# Altium schematic sheet mcu_stm32.SchDoc
size 297 x 209 mm
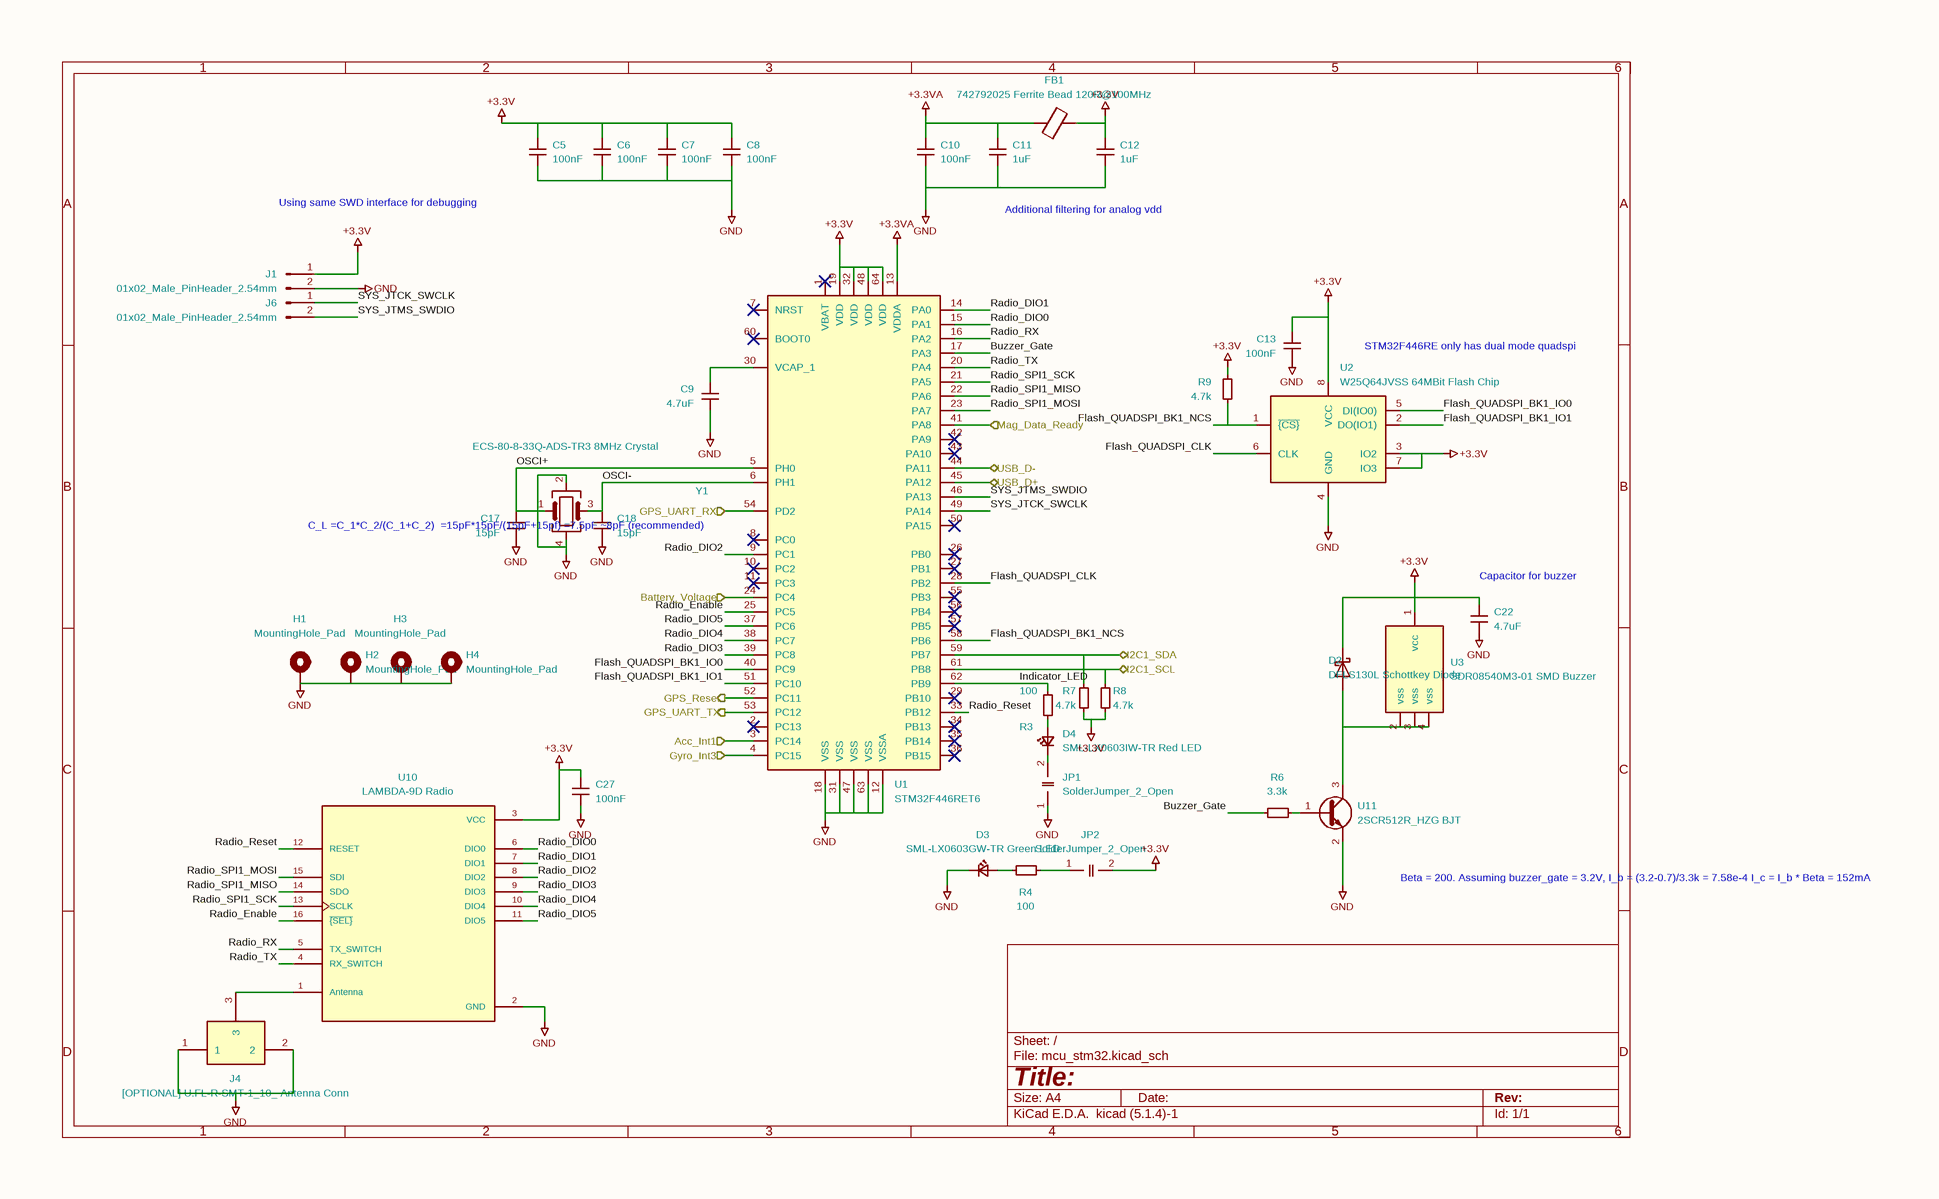
[diagram p0: mcu_stm32.SchDoc]

## Parts
C5  100nF  [C_0603_1608Metric]
C6  100nF  [C_0603_1608Metric]
C7  100nF  [C_0603_1608Metric]
C8  100nF  [C_0603_1608Metric]
C9  4.7uF  [C_0603_1608Metric]
C10  100nF  [C_0603_1608Metric]
C11  1uF  [C_0603_1608Metric]
C12  1uF  [C_0603_1608Metric]
C13  100nF  [C_0603_1608Metric]
C17  15pF  [C_0603_1608Metric]
C18  15pF  [C_0603_1608Metric]
C22  4.7uF  [C_0603_1608Metric]
C27  100nF  [C_0603_1608Metric_Pad1.08x0.95mm_HandSolder]
D2  DFLS130L Schottkey Diode  [PowerDI123]
D3  SML-LX0603GW-TR Green LED  [C_0603_1608Metric]
D4  SML-LX0603IW-TR Red LED  [C_0603_1608Metric]
FB1  742792025 Ferrite Bead 120R@100MHz  [R_0805_2012Metric_Pad1.20x1.40mm_HandSolder]
H1  MountingHole_Pad  [MountingHole_3.2mm_M3_ISO7380_Pad_TopBottom]
H2  MountingHole_Pad  [MountingHole_3.2mm_M3_ISO7380_Pad_TopBottom]
H3  MountingHole_Pad  [MountingHole_3.2mm_M3_ISO7380_Pad_TopBottom]
H4  MountingHole_Pad  [MountingHole_3.2mm_M3_ISO7380_Pad_TopBottom]
J1  01x02_Male_PinHeader_2.54mm  [PinHeader_1x02_P2.54mm_Vertical]
J4  [OPTIONAL] U.FL-R-SMT-1_10_ Antenna Conn  [U.FL-R-SMT-1_10_]
J6  01x02_Male_PinHeader_2.54mm  [PinHeader_1x02_P2.54mm_Vertical]
JP1  SolderJumper_2_Open  [SolderJumper-2_P1.3mm_Open_TrianglePad1.0x1.5mm]
JP2  SolderJumper_2_Open  [SolderJumper-2_P1.3mm_Open_TrianglePad1.0x1.5mm]
R3  100  [R_0603_1608Metric]
R4  100  [R_0603_1608Metric]
R6  3.3k  [R_0603_1608Metric]
R7  4.7k  [R_0603_1608Metric]
R8  4.7k  [R_0603_1608Metric]
R9  4.7k  [R_0603_1608Metric]
U1  STM32F446RET6  [LQFP-64_10x10mm_P0.5mm]
U2  W25Q64JVSS 64MBit Flash Chip  [W25Q64JVSSIQ]
U3  SDR08540M3-01 SMD Buzzer  [SDR08540M3-01 Buzzer]
U10  LAMBDA-9D Radio  [XCVR_LAMBDA-9D]
U11  2SCR512R_HZG BJT  [2SCR512RHZG]
Y1  ECS-80-8-33Q-ADS-TR3 8MHz Crystal  [ECS-80-8-33Q-ADS-TR3 Crystal]

## Ports
Acc_Int1 (in), Battery_Voltage (in), GPS_Reset (out), GPS_UART_RX (in), GPS_UART_TX (out), Gyro_Int3 (in), I2C1_SCL (bidir), I2C1_SDA (bidir), Mag_Data_Ready (in), USB_D+ (bidir), USB_D- (bidir)

## Nets
+3.3V: C5.1 C6.1 C7.1 C8.1 C12.1 C13.1 C22.1 C27.1 D2.1(K) FB1.2 J1.1(Pin_1) JP2.2(B) R7.2 R8.2 R9.1 U1.19(VDD) U1.32(VDD) U1.48(VDD) U1.64(VDD) U2.3(IO2) U2.7(IO3) U2.8(VCC) U3.1(vcc) U10.3(VCC)
+3.3VA: C10.1 C11.1 FB1.1 U1.13(VDDA)
GND: C5.2 C6.2 C7.2 C8.2 C9.2 C10.2 C11.2 C12.2 C13.2 C17.2 C18.2 C22.2 C27.2 D3.1(K) H1.1 H2.1 H3.1 H4.1 J1.2(Pin_2) J4.1 J4.2 JP1.1(A) U1.12(VSSA) U1.18(VSS) U1.31(VSS) U1.47(VSS) U1.63(VSS) U2.4(GND) U10.2(GND) U11.2(E) Y1.2 Y1.4
Acc_Int1: U1.3(PC14) ; port Acc_Int1
Battery_Voltage: U1.24(PC4) ; port Battery_Voltage
Buzzer_Gate: R6.1 U1.17(PA3)
Flash_QUADSPI_BK1_IO0: U1.40(PC9) U2.5(DI(IO0))
Flash_QUADSPI_BK1_IO1: U1.51(PC10) U2.2(DO(IO1))
Flash_QUADSPI_BK1_NCS: R9.2 U1.58(PB6) U2.1(~{{CS}})
Flash_QUADSPI_CLK: U1.28(PB2) U2.6(CLK)
GPS_Reset: U1.52(PC11) ; port GPS_Reset
GPS_UART_RX: U1.54(PD2) ; port GPS_UART_RX
GPS_UART_TX: U1.53(PC12) ; port GPS_UART_TX
Gyro_Int3: U1.4(PC15) ; port Gyro_Int3
I2C1_SCL: R8.1 U1.61(PB8) ; port I2C1_SCL
I2C1_SDA: R7.1 U1.59(PB7) ; port I2C1_SDA
Indicator_LED: R3.1 U1.62(PB9)
Mag_Data_Ready: U1.41(PA8) ; port Mag_Data_Ready
OSCI+: C17.1 U1.5(PH0) Y1.1
OSCI-: C18.1 U1.6(PH1) Y1.3
Radio_DIO0: U1.15(PA1) U10.6(DIO0)
Radio_DIO1: U1.14(PA0) U10.7(DIO1)
Radio_DIO2: U1.9(PC1) U10.8(DIO2)
Radio_DIO3: U1.39(PC8) U10.9(DIO3)
Radio_DIO4: U1.38(PC7) U10.10(DIO4)
Radio_DIO5: U1.37(PC6) U10.11(DIO5)
Radio_Enable: U1.25(PC5) U10.16(~{{SEL}})
Radio_Reset: U1.33(PB12) U10.12(RESET)
Radio_RX: U1.16(PA2) U10.5(TX_SWITCH)
Radio_SPI1_MISO: U1.22(PA6) U10.14(SDO)
Radio_SPI1_MOSI: U1.23(PA7) U10.15(SDI)
Radio_SPI1_SCK: U1.21(PA5) U10.13(SCLK)
Radio_TX: U1.20(PA4) U10.4(RX_SWITCH)
SYS_JTCK_SWCLK: J6.1(Pin_1) U1.49(PA14)
SYS_JTMS_SWDIO: J6.2(Pin_2) U1.46(PA13)
USB_D+: U1.45(PA12) ; port USB_D+
USB_D-: U1.44(PA11) ; port USB_D-
NetC9_1: C9.1 U1.30(VCAP_1)
NetD2_2: D2.2(A) U3.2(vss) U3.3(vss) U3.4(vss) U11.3(C)
NetD3_2: D3.2(A) R4.1
NetD4_1: D4.1(K) JP1.2(B)
NetD4_2: D4.2(A) R3.2
NetJ4_3: J4.3 U10.1(Antenna)
NetJP2_1: JP2.1(A) R4.2
NetR6_2: R6.2 U11.1(B)

Not connected (* = marked no-connect by the designer): U1 1(VBAT)* 2(PC13)* 7(NRST)* 8(PC0)* 10(PC2)* 11(PC3)* 26(PB0)* 27(PB1)* 29(PB10)* 34(PB13)* 35(PB14)* 36(PB15)* 42(PA9)* 43(PA10)* 50(PA15)* 55(PB3)* 56(PB4)* 57(PB5)* 60(BOOT0)*

## Notes on the sheet
- Using same SWD interface for debugging
- Additional filtering for analog vdd
- (near U2) STM32F446RE only has dual mode quadspi
- C_L
  =C_1*C_2/(C_1+C_2)
  =15pF*15pF/(15pF+15pf)
  =7.5pF ~8pF (recommended)
- (near C22) Capacitor for buzzer
- Beta = 200.
  Assuming buzzer_gate = 3.2V,
  I_b = (3.2-0.7)/3.3k = 7.58e-4
  I_c = I_b * Beta = 152mA
- 1
- 2
- 3
- 4
- 5
- 6
- A
- B
- C
- D
- Title:
- File: mcu_stm32.kicad_sch
- Sheet: /
- KiCad E.D.A.  kicad (5.1.4)-1
- Size: A4
- Date:
- Rev:
- Id: 1/1

## Library data of the parts
C5-C13 C17 C18 C22 = C_0603: Footprint: Components:C_0603_1608Metric
  C5-C8 C10 C13: Value: 100nF
  C9 C22: Value: 4.7uF
  C11 C12: Value: 1uF
  C17 C18: Value: 15pF
C27 = C_Small: Value: 100nF; Footprint: Capacitor_SMD:C_0603_1608Metric_Pad1.08x0.95mm_HandSolder
D2 = DFLS130L: Value: DFLS130L Schottkey Diode; Footprint: Components:PowerDI123
D3 D4 = LED_0603: Footprint: Components:C_0603_1608Metric
  D3: Value: SML-LX0603GW-TR Green LED
  D4: Value: SML-LX0603IW-TR Red LED
FB1 = FerriteBead: Value: 742792025 Ferrite Bead 120R@100MHz; Footprint: Resistor_SMD:R_0805_2012Metric_Pad1.20x1.40mm_HandSolder
J1 J6 = Conn_01x02_Male: Value: 01x02_Male_PinHeader_2.54mm; Footprint: Connector_PinHeader_2.54mm:PinHeader_1x02_P2.54mm_Vertical
J4 = U.FL-R-SMT-1_10_: Manufacturer_Name: Hirose; Manufacturer_Part_Number: U.FL-R-SMT-1(10); Mouser Part Number: 798-U.FL-R-SMT-110; Mouser Price/Stock: https://www.mouser.co.uk/ProductDetail/Hirose-Connector/U.FL-R-SMT-110?qs=kL1ClTr6oBoOdtqlGQpQrQ%3D%3D; Arrow Part Number: U.FL-R-SMT-1(10); Arrow Price/Stock: https://www.arrow.com/en/products/u.fl-r-smt-1-10/hirose-electric; Value: [OPTIONAL] U.FL-R-SMT-1_10_ Antenna Conn; Footprint: Components:U.FL-R-SMT-1_10_
R3 R4 R6-R9 = R_0603: Footprint: Components:R_0603_1608Metric
  R3 R4: Value: 100
  R6: Value: 3.3k
  R7-R9: Value: 4.7k
U1 = STM32F446RETx: Value: STM32F446RET6; Footprint: Components:LQFP-64_10x10mm_P0.5mm
U2 = W25Q64JVSS: Value: W25Q64JVSS 64MBit Flash Chip; Footprint: Components:W25Q64JVSSIQ
U3 = SDR08540M3-01: Value: SDR08540M3-01 SMD Buzzer; Footprint: Components:SDR08540M3-01 Buzzer
U10 = LAMBDA-9D: MANUFACTURER: RF Solutions; SNAPEDA_PACKAGE_ID: 63698; MAXIMUM_PACKAGE_HEIGHT: 5.81 mm; STANDARD: Manufacturer Recommendations; PARTREV: N/A; SNAPEDA_PN: LAMBDA-9D; Value: LAMBDA-9D Radio; Footprint: Components:XCVR_LAMBDA-9D
U11 = 2SCR512R_HZG: Value: 2SCR512R_HZG BJT; Footprint: Components:2SCR512RHZG
Y1 = Crystal_GND24: Value: ECS-80-8-33Q-ADS-TR3 8MHz Crystal; Footprint: Components:ECS-80-8-33Q-ADS-TR3 Crystal
H1-H4 = MountingHole_Pad: Value: MountingHole_Pad; Footprint: MountingHole:MountingHole_3.2mm_M3_ISO7380_Pad_TopBottom
JP1 JP2 = SolderJumper_2_Open: Value: SolderJumper_2_Open; Footprint: Jumper:SolderJumper-2_P1.3mm_Open_TrianglePad1.0x1.5mm